# Altium schematic sheet 5V_Isolated_Bias.SchDoc
size B
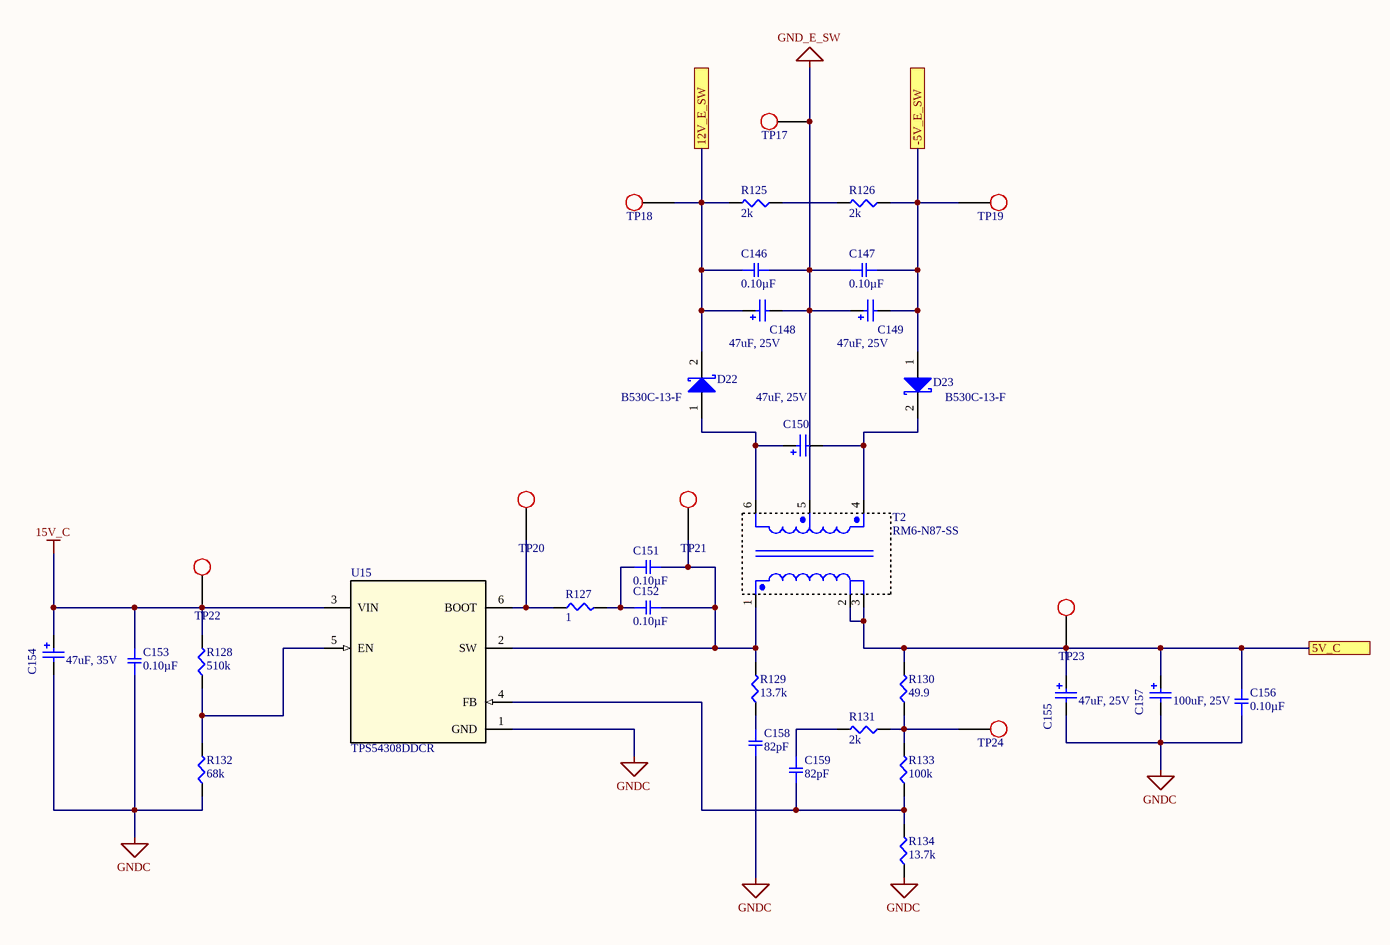
[diagram p0: 5V_Isolated_Bias.SchDoc]

## Parts
C146  0.10µF  [SMD-0603C]
C147  0.10µF  [SMD-0603C]
C148  47uF, 25V  [WCAP-ASLL_6.3x5.5]
C149  47uF, 25V  [WCAP-ASLL_6.3x5.5]
C150  47uF, 25V  [WCAP-ASLL_6.3x5.5]
C151  0.10µF  [SMD-0805C]
C152  0.10µF  [SMD-0805C]
C153  0.10µF  [SMD-0805C]
C154  47uF, 35V  [WCAP-ASLL_6.3x5.5]
C155  47uF, 25V  [WCAP-ASLL_6.3x5.5]
C156  0.10µF  [SMD-0603C]
C157  100uF, 25V  [WCAP-ASLU_8x6.5]
C158  82pF  [SMD-0805C]
C159  82pF  [SMD-0805C]
D22  B530C-13-F  [DIOD-SMC-2_V]
D23  B530C-13-F  [DIOD-SMC-2_V]
R125  2k  [SMD-0603-RES]
R126  2k  [SMD-0603-RES]
R127  1  [SMD-0603-RES]
R128  510k  [SMD-0603-RES]
R129  13.7k  [SMD-0603-RES]
R130  49.9  [SMD-0603-RES]
R131  2k  [SMD-0603-RES]
R132  68k  [SMD-0603-RES]
R133  100k  [SMD-0603-RES]
R134  13.7k  [SMD-0603-RES]
T2  RM6-N87-SS  [RM6-N87-SS]
TP17  Test Point  [Test_point_THT]  (value not drawn)  (no BOM)
TP18  Test Point  [Test_point_THT]  (value not drawn)  (no BOM)
TP19  Test Point  [Test_point_THT]  (value not drawn)  (no BOM)
TP20  Test Point  [Test_point_THT]  (value not drawn)  (no BOM)
TP21  Test Point  [Test_point_THT]  (value not drawn)  (no BOM)
TP22  Test Point  [Test_point_THT]  (value not drawn)  (no BOM)
TP23  Test Point  [Test_point_THT]  (value not drawn)  (no BOM)
TP24  Test Point  [Test_point_THT]  (value not drawn)  (no BOM)
U15  TPS54308DDCR  [SOT95P278X110-6N]

## Ports
5V_C, 12V_E_SW, -5V_E_SW

## Nets
15V_C: C153.2 C154.2(P) R128.2 TP22.1 U15.3(VIN)
GND_E_SW: C146.2 C147.1 C148.1(N) C149.2(P) T2.5 TP17.1
GNDC: C153.1 C154.1(N) C155.1(N) C156.1 C157.1(N) C158.2 R132.1 R134.1 U15.1(GND)
5V_C: C155.2(P) C156.2 C157.2(P) R130.2 T2.2 T2.3 TP23.1 ; port 5V_C
12V_E_SW: C146.1 C148.2(P) D22.2(K) R125.2 TP18.1 ; port 12V_E_SW
-5V_E_SW: C147.2 C149.1(N) D23.1(A) R126.1 TP19.1 ; port -5V_E_SW
NetC150_1: C150.1(N) D23.2(K) T2.4
NetC150_2: C150.2(P) D22.1(A) T2.6
NetC151_1: C151.1 C152.1 R127.2
NetC151_2: C151.2 C152.2 R129.2 T2.1 TP21.1 U15.2(SW)
NetC158_1: C158.1 R129.1
NetC159_1: C159.1 R131.2
NetC159_2: C159.2 R133.1 R134.2 U15.4(FB)
NetR125_1: R125.1 R126.2
NetR127_1: R127.1 TP20.1 U15.6(BOOT)
NetR128_1: R128.1 R132.2 U15.5(EN)
NetR130_1: R130.1 R131.1 R133.2 TP24.1

Not connected (* = marked no-connect by the designer): T2 8

## Library data of the parts
C146 C147 C156 = GCM188R71C104KA37D: CAP CER 0.1UF 16V X7R 0603; Manufacturer: Murata Electronics North America; Factory Stock: 0; Unit Price (USD): 0.18; Minimum Quantity: 1; Tolerance: ±10%; Datasheets: http://www.murata.com/~/media/webrenewal/support/library/catalog/products/capacitor/mlcc/c03e.ashx; Image: //media.digikey.com/Renders/Murata%20Renders/0603%28GCM188%29.jpg; Digi-Key Part Number: 490-4774-1-ND; Part Number: GCM188R71C104KA37D; Quantity Available: 284085; @ qty: 0; Packaging: Cut Tape (CT); Series: GCM; Part Status: Active; Value: 0.10µF; Voltage: 16V; Temperature Coefficient: X7R; Operating Temperature: -55°C ~ 125°C; Features: -; Ratings: AEC-Q200; Applications: Automotive; Mounting Type: Surface Mount, MLCC; Package / Case: 0603 (1608 Metric); Size / Dimension: 0.063" L x 0.031" W (1.60mm x 0.80mm); Height - Seated (Max): -; Thickness (Max): 0.035" (0.90mm); Lead Spacing: -; Lead Style: -
C148-C150 C155 = 865060443004: WCAP-ASLL SMT Aluminum Electrolytic Capacitors, D6.3mm x L5.5mm, 47uF, +/-20%, 25VDC; Dissipation Factor: 14%; Endurance: 2000h; Leakage Current: 11.75uA; Ripple Current max.: 230mA; Technical Reference: ASED055470M025DVCTBB000; ComponentLink1Description: Manufacturer; ComponentLink1URL: http://www.we-online.de; ComponentLink2Description: Datasheet; ComponentLink2URL: https://katalog.we-online.com/pbs/datasheet/865060443004.pdf; Length: 5.5mm; Mounting Technology: SMT; Operating Temperature: -55 to +105degC; Packaging: Tape and Reel; Published Date: August 2019; Capacitance: 47uF; Diameter: 6.3mm; Part Number: 865060443004; Publisher: Wurth Elektronik; Capacitance Tolerance: +/-20%; Rated Voltage: 25VDC
C151-C153 = GCD21BR71H104KA01L: CAP CER 0.1UF 50V X7R 0805; Manufacturer: Murata Electronics North America; Factory Stock: 0; Unit Price (USD): 0.24; Minimum Quantity: 1; Tolerance: ±10%; Datasheets: http://www.murata.com/~/media/webrenewal/support/library/catalog/products/capacitor/mlcc/c03e.ashx; Image: //media.digikey.com/Renders/Murata%20Renders/0805%28GxM6%29.jpg; Digi-Key Part Number: 490-11955-1-ND; Part Number: GCD21BR71H104KA01L; Quantity Available: 157; @ qty: 0; Packaging: Cut Tape (CT); Series: GCD; Part Status: Active; Value: 0.10µF; Voltage: 50V; Temperature Coefficient: X7R; Operating Temperature: -55°C ~ 125°C; Features: -; Ratings: AEC-Q200; Applications: Automotive; Mounting Type: Surface Mount, MLCC; Package / Case: 0805 (2012 Metric); Size / Dimension: 0.079" L x 0.049" W (2.00mm x 1.25mm); Height - Seated (Max): -; Thickness (Max): 0.049" (1.25mm); Lead Spacing: -; Lead Style: -
C154 = 865060543005: WCAP-ASLL SMT Aluminum Electrolytic Capacitors, D6.3mm x L5.5mm, 47uF, +/-20%, 35VDC; Dissipation Factor: 14%; Endurance: 2000h; Leakage Current: 16.45uA; Ripple Current max.: 240mA; Technical Reference: ASED055470M035DVCTBB000; ComponentLink1Description: Manufacturer; ComponentLink1URL: http://www.we-online.de; ComponentLink2Description: Datasheet; ComponentLink2URL: https://katalog.we-online.com/pbs/datasheet/865060543005.pdf; Length: 5.5mm; Mounting Technology: SMT; Operating Temperature: -55 to +105degC; Packaging: Tape and Reel; Published Date: August 2019; Capacitance: 47uF; Diameter: 6.3mm; Part Number: 865060543005; Publisher: Wurth Elektronik; Capacitance Tolerance: +/-20%; Rated Voltage: 35VDC
C157 = 865090449009: WCAP-ASLU Aluminium Electrolytic Capacitors, D8mm x L6.5mm, 100uF, +/-20%, 25VDC; Dissipation Factor: 16%; Leakage Current: 5uA; Endurance: 1000h; Technical Reference: ASBE065101M025DVCTBA000; Ripple Current max.: 110mA; ComponentLink1Description: Manufacturer; ComponentLink1URL: http://www.we-online.de; ComponentLink2Description: Datasheet; ComponentLink2URL: https://katalog.we-online.com/pbs/datasheet/865090449009.pdf; Mounting Technology: SMD; Operating Temperature: -40 to +85degC; Packaging: Tape and Reel; Part Number: 865090449009; Publisher: Wurth Elektronik; Capacitance: 100uF; Diameter: 8mm; Length: 6.5mm; Published Date: August 2019; Rated Voltage: 25VDC; Capacitance Tolerance: +/-20%
C158 C159 = GQM2195C1H820JB01D: CAP CER 82PF 50V NP0 0805; Manufacturer: Murata Electronics North America; Factory Stock: 0; Unit Price (USD): 1.22; Minimum Quantity: 1; Tolerance: ±5%; Temperature Coefficient: C0G, NP0; Datasheets: http://www.murata.com/~/media/webrenewal/support/library/catalog/products/capacitor/mlcc/c02e.pdf; Image: //media.digikey.com/Renders/Murata%20Renders/0805(GxM9).jpg; Digi-Key Part Number: 490-3615-1-ND; Part Number: GQM2195C1H820JB01D; Quantity Available: 7488; @ qty: 0; Packaging: Cut Tape (CT); Series: GQM; Part Status: Active; Value: 82pF; Voltage: 50V; Operating Temperature: -55°C ~ 125°C; Features: High Q, Low Loss; Ratings: -; Applications: RF, Microwave, High Frequency; Mounting Type: Surface Mount, MLCC; Package / Case: 0805 (2012 Metric); Size / Dimension: 0.079" L x 0.049" W (2.00mm x 1.25mm); Height - Seated (Max): -; Thickness (Max): 0.037" (0.95mm); Lead Spacing: -; Lead Style: -
D22 D23 = CMP-1693-00001-3: Surface Mount Schottky Barrier Rectifier, 5 A, 0.55 V, -55 to 150 degC, 2-Pin SMD, RoHS, Tape and Reel; Max Operating Temperature: 125 degC; ComponentLink2Description: Datasheet; PackageDescription: 2-Pin Surface Mount Device, Body 5.905 x 6.855 mm; Radiation Hardening: No; Mount: Surface Mount; Height: 2.3 mm; REACH SVHC: No SVHC; PartNumber: B530C-13-F; Packaging: Tape and Reel; Min Operating Temperature: -55 degC; Mounting Technology: Surface Mount; ComponentLink1URL: http://www.diodes.com/; ComponentLink1Description: Manufacturer URL; DatasheetVersion: Rev. 16-2; Length: 7.11 mm; ComponentLink2URL: http://www.diodes.com/_files/datasheets/ds13012.pdf; Package Quantity: 3000; Width: 6.22 mm; Case/Package: SMC; Pins: 2; RoHSCompliant: True
R125 R126 R131 = ERJ-3EKF2001V: RES SMD 2K OHM 1% 1/10W 0603; Manufacturer: Panasonic Electronic Components; Factory Stock: 0; Unit Price (USD): 0.00379; @ qty: 1500; Minimum Quantity: 1; Power (Watts): 0.1W, 1/10W; Temperature Coefficient: ±100ppm/°C; Part Number: ERJ-3EKF2001V; Datasheets: http://industrial.panasonic.com/www-cgi/jvcr13pz.cgi?E+PZ+3+AOA0002+ERJ3EKF2001V+7+WW; Image: //media.digikey.com/Photos/Panasonic%20Photos/MFG_ERJ-P6W%20Series.jpg; Digi-Key Part Number: P2.00KHCT-ND; Quantity Available: 1021544; Packaging: Cut Tape (CT); Series: ERJ; Part Status: Active; Value: 2k; Tolerance: ±1%; Composition: Thick Film; Features: Automotive AEC-Q200; Operating Temperature: -55°C ~ 155°C; Package / Case: 0603 (1608 Metric); Supplier Device Package: 0603; Size / Dimension: 0.063" L x 0.031" W (1.60mm x 0.80mm); Height - Seated (Max): 0.022" (0.55mm); Number of Terminations: 2; Failure Rate: -
R127 = ERJ-3BQF1R0V: RES SMD 1 OHM 1% 1/4W 0603; Manufacturer: Panasonic Electronic Components; Factory Stock: 0; Unit Price (USD): 0.05386; @ qty: 1500; Power (Watts): 0.25W, 1/4W; Temperature Coefficient: ±200ppm/°C; Part Number: ERJ-3BQF1R0V; Datasheets: https://industrial.panasonic.com/cdbs/www-data/pdf/RDA0000/AOA0000C239.pdf; Image: //media.digikey.com/Photos/Panasonic%20Photos/MFG_ERJ-P6W%20Series.jpg; Digi-Key Part Number: P17371CT-ND; Quantity Available: 30514; Minimum Quantity: 1; Packaging: Cut Tape (CT); Series: ERJ; Part Status: Active; Value: 1; Tolerance: ±1%; Composition: Thick Film; Features: Automotive AEC-Q200, Current Sense; Operating Temperature: -55°C ~ 125°C; Package / Case: 0603 (1608 Metric); Supplier Device Package: 0603; Size / Dimension: 0.063" L x 0.031" W (1.60mm x 0.80mm); Height - Seated (Max): 0.022" (0.55mm); Number of Terminations: 2; Failure Rate: -
R128 = ERJ-3EKF5103V: RES SMD 510K OHM 1% 1/10W 0603; Manufacturer: Panasonic Electronic Components; Factory Stock: 0; Unit Price (USD): 0.00379; @ qty: 1500; Minimum Quantity: 1; Power (Watts): 0.1W, 1/10W; Temperature Coefficient: ±100ppm/°C; Part Number: ERJ-3EKF5103V; Datasheets: http://industrial.panasonic.com/www-cgi/jvcr13pz.cgi?E+PZ+3+AOA0002+ERJ3EKF5103V+7+WW; Image: //media.digikey.com/Photos/Panasonic%20Photos/MFG_ERJ-P6W%20Series.jpg; Digi-Key Part Number: P510KHCT-ND; Quantity Available: 132059; Packaging: Cut Tape (CT); Series: ERJ; Part Status: Active; Value: 510k; Tolerance: ±1%; Composition: Thick Film; Features: Automotive AEC-Q200; Operating Temperature: -55°C ~ 155°C; Package / Case: 0603 (1608 Metric); Supplier Device Package: 0603; Size / Dimension: 0.063" L x 0.031" W (1.60mm x 0.80mm); Height - Seated (Max): 0.022" (0.55mm); Number of Terminations: 2; Failure Rate: -
R129 R134 = ERJ-3EKF1372V: RES SMD 13.7K OHM 1% 1/10W 0603; Manufacturer: Panasonic Electronic Components; Factory Stock: 0; Unit Price (USD): 0.00379; @ qty: 1500; Minimum Quantity: 1; Power (Watts): 0.1W, 1/10W; Temperature Coefficient: ±100ppm/°C; Part Number: ERJ-3EKF1372V; Datasheets: http://industrial.panasonic.com/www-cgi/jvcr13pz.cgi?E+PZ+3+AOA0002+ERJ3EKF1372V+7+WW; Image: //media.digikey.com/Photos/Panasonic%20Photos/MFG_ERJ-P6W%20Series.jpg; Digi-Key Part Number: P13.7KHCT-ND; Quantity Available: 81314; Packaging: Cut Tape (CT); Series: ERJ; Part Status: Active; Value: 13.7k; Tolerance: ±1%; Composition: Thick Film; Features: Automotive AEC-Q200; Operating Temperature: -55°C ~ 155°C; Package / Case: 0603 (1608 Metric); Supplier Device Package: 0603; Size / Dimension: 0.063" L x 0.031" W (1.60mm x 0.80mm); Height - Seated (Max): 0.022" (0.55mm); Number of Terminations: 2; Failure Rate: -
R130 = ERJ-3EKF49R9V: RES SMD 49.9 OHM 1% 1/10W 0603; Manufacturer: Panasonic Electronic Components; Factory Stock: 0; Unit Price (USD): 0.00379; @ qty: 1500; Minimum Quantity: 1; Power (Watts): 0.1W, 1/10W; Temperature Coefficient: ±100ppm/°C; Part Number: ERJ-3EKF49R9V; Datasheets: http://industrial.panasonic.com/www-cgi/jvcr13pz.cgi?E+PZ+3+AOA0002+ERJ3EKF49R9V+7+WW; Image: //media.digikey.com/Photos/Panasonic%20Photos/MFG_ERJ-P6W%20Series.jpg; Digi-Key Part Number: P49.9HCT-ND; Quantity Available: 566023; Packaging: Cut Tape (CT); Series: ERJ; Part Status: Active; Value: 49.9; Tolerance: ±1%; Composition: Thick Film; Features: Automotive AEC-Q200; Operating Temperature: -55°C ~ 155°C; Package / Case: 0603 (1608 Metric); Supplier Device Package: 0603; Size / Dimension: 0.063" L x 0.031" W (1.60mm x 0.80mm); Height - Seated (Max): 0.022" (0.55mm); Number of Terminations: 2; Failure Rate: -
R132 = ERJ-3EKF6802V: RES SMD 68K OHM 1% 1/10W 0603; Manufacturer: Panasonic Electronic Components; Factory Stock: 0; Unit Price (USD): 0.00379; @ qty: 1500; Minimum Quantity: 1; Power (Watts): 0.1W, 1/10W; Temperature Coefficient: ±100ppm/°C; Part Number: ERJ-3EKF6802V; Datasheets: http://industrial.panasonic.com/www-cgi/jvcr13pz.cgi?E+PZ+3+AOA0002+ERJ3EKF6802V+7+WW; Image: //media.digikey.com/Photos/Panasonic%20Photos/MFG_ERJ-P6W%20Series.jpg; Digi-Key Part Number: P68.0KHCT-ND; Quantity Available: 63788; Packaging: Cut Tape (CT); Series: ERJ; Part Status: Active; Value: 68k; Tolerance: ±1%; Composition: Thick Film; Features: Automotive AEC-Q200; Operating Temperature: -55°C ~ 155°C; Package / Case: 0603 (1608 Metric); Supplier Device Package: 0603; Size / Dimension: 0.063" L x 0.031" W (1.60mm x 0.80mm); Height - Seated (Max): 0.022" (0.55mm); Number of Terminations: 2; Failure Rate: -
R133 = ERJ-3GEYJ104V: RES SMD 100K OHM 5% 1/10W 0603; Manufacturer: Panasonic Electronic Components; Factory Stock: 0; Unit Price (USD): 0.00321; @ qty: 1500; Minimum Quantity: 1; Power (Watts): 0.1W, 1/10W; Temperature Coefficient: ±200ppm/°C; Part Number: ERJ-3GEYJ104V; Datasheets: http://industrial.panasonic.com/www-cgi/jvcr13pz.cgi?E+PZ+3+AOA0001+ERJ3GEYJ104V+7+WW; Image: //media.digikey.com/Photos/Panasonic%20Photos/MFG_ERJ-P6W%20Series.jpg; Digi-Key Part Number: P100KGCT-ND; Quantity Available: 1377078; Packaging: Cut Tape (CT); Series: ERJ; Part Status: Active; Value: 100k; Tolerance: ±5%; Composition: Thick Film; Features: Automotive AEC-Q200; Operating Temperature: -55°C ~ 155°C; Package / Case: 0603 (1608 Metric); Supplier Device Package: 0603; Size / Dimension: 0.063" L x 0.031" W (1.60mm x 0.80mm); Height - Seated (Max): 0.022" (0.55mm); Number of Terminations: 2; Failure Rate: -
TP17-TP24 = Test Point: TP
U15 = TPS54308DDCR: Imported; Manufacturer: Texas Instruments; PartNumber: TPS54308DDCR; RefDes: RefDes; Type: DEV; Value: Value; Manufacturer_Part_Number: TPS54308DDCR; Manufacturer_Name: Texas Instruments